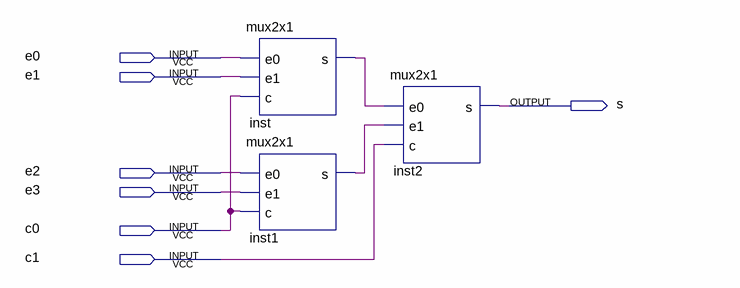
[diagram p0: schematic sheet]
// Quartus schematic mux4x1.bdf as structural Verilog: 3 symbols, 7 pins
module mux4x1 (
  input  e0,
  input  e1,
  input  e2,
  input  e3,
  input  c0,
  input  c1,
  output s
);

  wire inst1_s, inst_s;

  mux2x1 inst (.e0(e0), .e1(e1), .c(c0), .s(inst_s));
  mux2x1 inst1 (.e0(e2), .e1(e3), .c(c0), .s(inst1_s));
  mux2x1 inst2 (.e0(inst_s), .e1(inst1_s), .c(c1), .s(s));
endmodule
